# EAGLE schematic DC Converter Mockup (EAGLE 9.2.2)
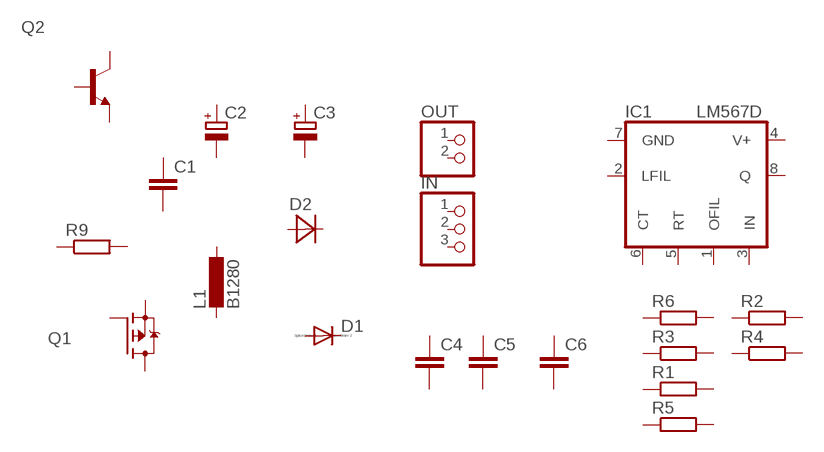
[diagram p0: schematic, sheet 1]

## Parts
C1  C-EUC1812  [C1812]
C2  CPOL-EUF  [PANASONIC_F]
C3  CPOL-EUG  [PANASONIC_G]
C4  C-EUC0603  [C0603]
C5  C-EUC0603  [C0603]
C6  C-EUC0603  [C0603]
D1  DIODE-SMC  [SMC]
D2  MBRA340T3  [SMA]
IC1  LM567D  [SO08]
IN  PINHD-1X3  [1X03]
L1  B1280  [INDUCTOR-12X12]
OUT  PINHD-1X2  [1X02]
Q1  FDD4141TO252  [TO252]
Q2  -NPN-SOT23-EBC  [SOT23-EBC]
R1  R-EU_R0603  [R0603]
R2  R-EU_R0603  [R0603]
R3  R-EU_R0603  [R0603]
R4  R-EU_R0603  [R0603]
R5  R-EU_R0603  [R0603]
R6  R-EU_R0603  [R0603]
R9  R-EU_R1210  [R1210]
Unconnected: C1.1 C1.2 C2.+ C2.- C3.+ C3.- C4.1 C4.2 C5.1 C5.2 C6.1 C6.2 D1.A D1.C D2.A D2.C IC1.1(OFIL) IC1.2(LFIL) IC1.3(IN) IC1.5(RT) IC1.6(CT) IC1.8(Q) IN.1 IN.2 IN.3 L1.1 L1.2 OUT.1 OUT.2 Q1.1(G) Q1.2(S) Q1.3(D) Q2.B Q2.C Q2.E R1.1 R1.2 R2.1 R2.2 R3.1 R3.2 R4.1 R4.2 R5.1 R5.2 R6.1 R6.2 R9.1 R9.2

## Power pins joined to a net without a drawn wire
GND: IC1.7(GND)
V+: IC1.4(V+)

## Library data of the parts
C1 C4-C6 = rcl:C-EU: CAPACITOR, European symbol; SPICEPREFIX: C
C2 C3 = rcl:CPOL-EU: POLARIZED CAPACITOR, European symbol; SPICEPREFIX: C
D1 = diode:DIODE-: DIODE
D2 = diode:MBRA340T3: Surface Mount Schottky Power Rectifier Source: http://www.onsemi.com/pub_link/Collateral/MBRA340T3-D.PDF
IC1 = linear:*567: TONE DECODER
IN = pinhead:PINHD-1X3: PIN HEADER
L1 = NixieClock:B1280
OUT = pinhead:PINHD-1X2: PIN HEADER
Q1 = transistor-fet:FDD4141: P-Channel PowerTrench® MOSFET Source: FDD4141.pdf
Q2 = transistor:*-NPN-: NPN Transistror BF959 corrected 2008.03.06
R1-R6 R9 = rcl:R-EU_: RESISTOR, European symbol; SPICEPREFIX: R